# EAGLE design ESP (EAGLE 7.6.0)
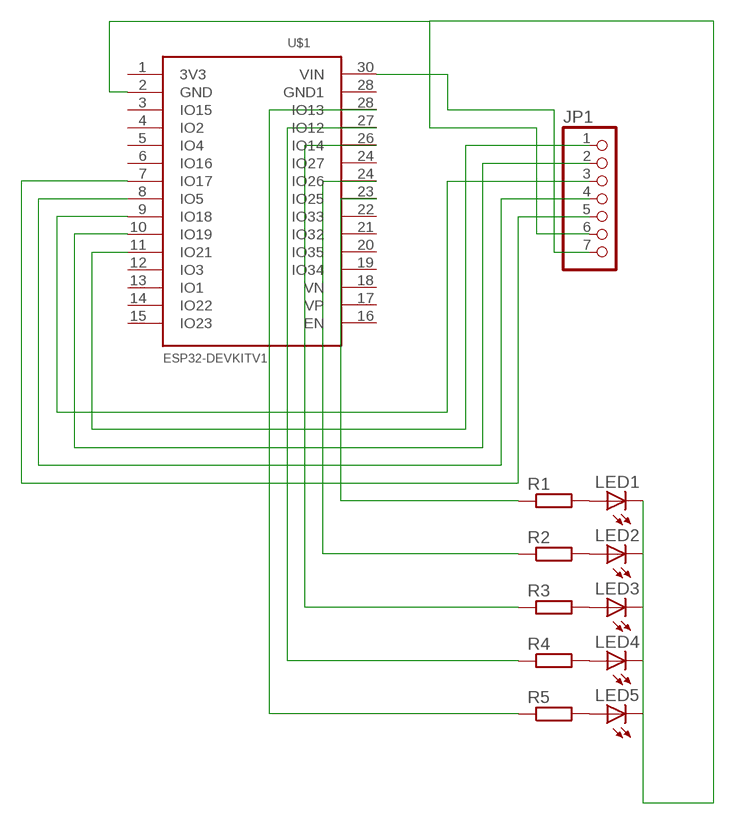
[diagram p0: schematic, sheet 1]

## Parts
JP1  PINHD-1X7  [1X07]
LED1  LED5MM  [LED5MM]
LED2  LED5MM  [LED5MM]
LED3  LED5MM  [LED5MM]
LED4  LED5MM  [LED5MM]
LED5  LED5MM  [LED5MM]
R1  R-EU_0207/7  [0207/7]
R2  R-EU_0207/7  [0207/7]
R3  R-EU_0207/7  [0207/7]
R4  R-EU_0207/7  [0207/7]
R5  R-EU_0207/7  [0207/7]
U$1  ESP32DEVKITV1  [ESP32-DEVKITV1]

## Nets
N$1: JP1.7 U$1.30(VIN)
N$2: JP1.6 LED1.K(C) LED2.K(C) LED3.K(C) LED4.K(C) LED5.K(C) U$1.2(GND)
N$3: R2.1 U$1.24(IO26)
N$4: JP1.1 U$1.11(IO21)
N$5: JP1.2 U$1.10(IO19)
N$6: JP1.3 U$1.9(IO18)
N$7: JP1.4 U$1.8(IO5)
N$8: LED1.A R1.2
N$9: LED2.A R2.2
N$10: LED3.A R3.2
N$11: LED4.A R4.2
N$12: LED5.A R5.2
N$13: JP1.5 U$1.7(IO17)
N$14: R1.1 U$1.23(IO25)
N$15: R3.1 U$1.26(IO14)
N$16: R4.1 U$1.27(IO12)
N$17: R5.1 U$1.28(IO13)
Unconnected: U$1.1(3V3) U$1.3(IO15) U$1.4(IO2) U$1.5(IO4) U$1.6(IO16) U$1.12(IO3) U$1.13(IO1) U$1.14(IO22) U$1.15(IO23) U$1.16(EN) U$1.17(VP) U$1.18(VN) U$1.19(IO34) U$1.20(IO35) U$1.21(IO32) U$1.22(IO33) U$1.24(IO27) U$1.28(GND1)

## Library data of the parts
JP1 = pinhead:PINHD-1X7: PIN HEADER
LED1-LED5 = led:LED: LED OSRAM: - CHIPLED LG R971, LG N971, LY N971, LG Q971, LY Q971, LO R971, LY R971 LH N974, LH R974 LS Q976, LO Q976, LY Q976 LO Q996 - Hyper CHIPLED LW Q18S LB Q993, LB Q99A, LB R99A - SideLED LS A670, LO A670, LY A670, LG A670, LP A670 LB A673, LV A673, LT A673, LW A673 LH A674 LY A675 LS A676, LA A676, LO A676, LY A676, LW A676 LS A679, LY A679, LG A679 - Hyper Micro SIDELED® LS Y876, LA Y876, LO Y876, LY Y876 LT Y87S - SmartLED LW L88C, LW L88S LB L89C, LB L89S, LG L890 LS L89K, LO L89K, LY L89K LS L896, LA L896, LO L896, LY L896 - TOPLED LS T670, LO T670, LY T670, LG T670, LP T670 LSG T670, LSP T670, LSY T670, LOP T670, LYG T670 LG T671, LOG T671, LSG T671 LB T673, LV T673, LT T673, LW T673 LH T674 LS T676, LA T676, LO T676, LY T676, LB T676, LH T676, LSB T676, LW T676 LB T67C, LV T67C, LT T67C, LS T67K, LO T67K, LY T67K, LW E67C LS E67B, LA E67B, LO E67B, LY E67B, LB E67C, LV E67C, LT E67C LW T67C LS T679, LY T679, LG T679 LS T770, LO T770, LY T770, LG T770, LP T770 LB T773, LV T773, LT T773, LW T773 LH T774 LS E675, LA E675, LY E675, LS T675 LS T776, LA T776, LO T776, LY T776, LB T776 LHGB T686 LT T68C, LB T68C - Hyper Mini TOPLED® LB M676 - Mini TOPLED Santana® LG M470 LS M47K, LO M47K, LY M47K Source: http://www.osram.convergy.de LUXEON: - LUMILED® LXK2-PW12-R00, LXK2-PW12-S00, LXK2-PW14-U00, LXK2-PW14-V00 LXK2-PM12-R00, LXK2-PM12-S00, LXK2-PM14-U00 LXK2-PE12-Q00, LXK2-PE12-R00, LXK2-PE12-S00, LXK2-PE14-T00, LXK2-PE14-U00 LXK2-PB12-K00, LXK2-PB12-L00, LXK2-PB12-M00, LXK2-PB14-N00, LXK2-PB14-P00, LXK2-PB14-Q00 LXK2-PR12-L00, LXK2-PR12-M00, LXK2-PR14-Q00, LXK2-PR14-R00 LXK2-PD12-Q00, LXK2-PD12-R00, LXK2-PD12-S00 LXK2-PH12-R00, LXK2-PH12-S00 LXK2-PL12-P00, LXK2-PL12-Q00, LXK2-PL12-R00 Source: www.luxeon.com KINGBRIGHT: KA-3528ASYC Source: www.kingbright.com
R1-R5 = resistor:R-EU_: RESISTOR, European symbol
U$1 = ESP32-DEVKITV1:ESP32DEVKITV1

## Board
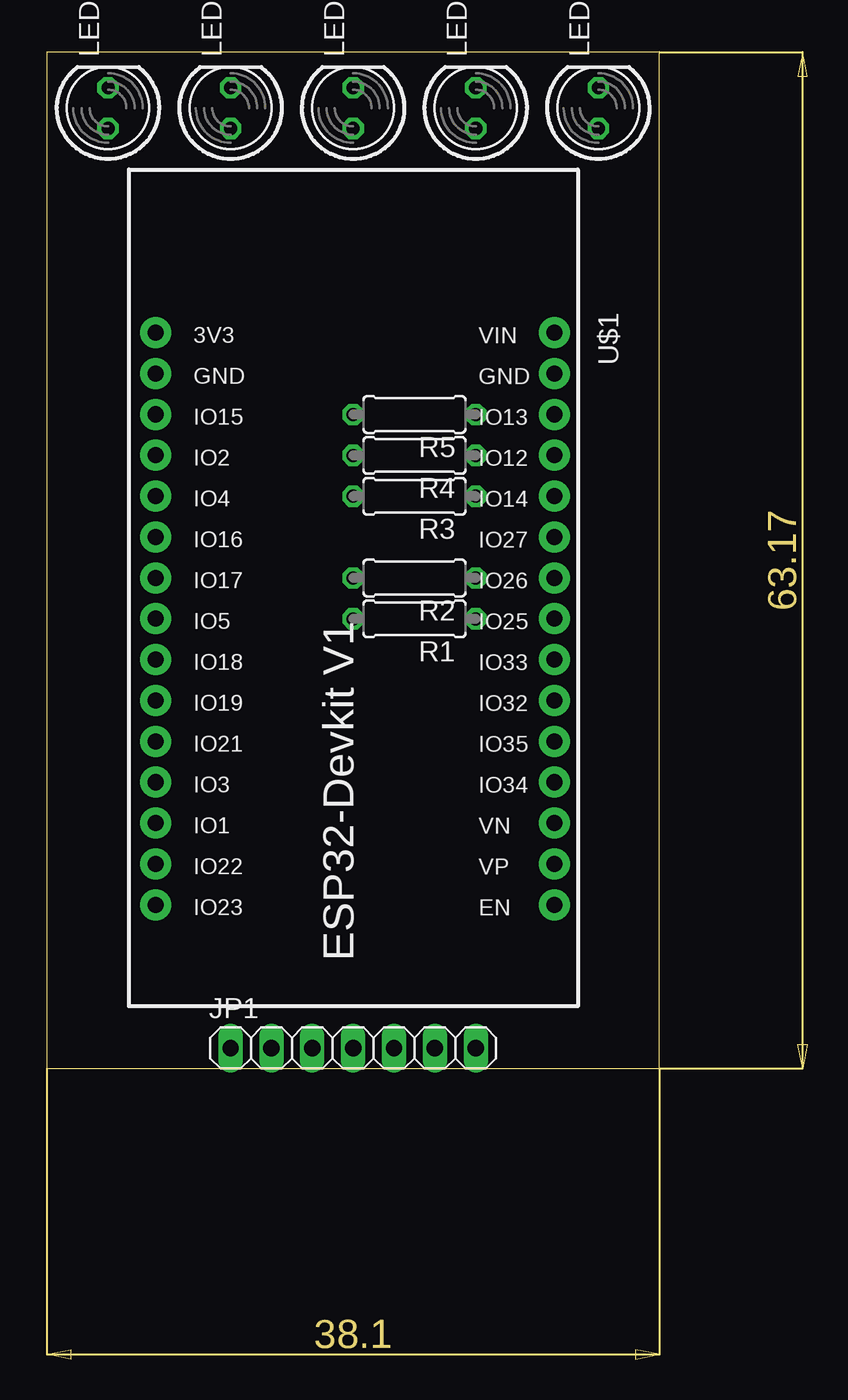
[diagram p1: board, top side]
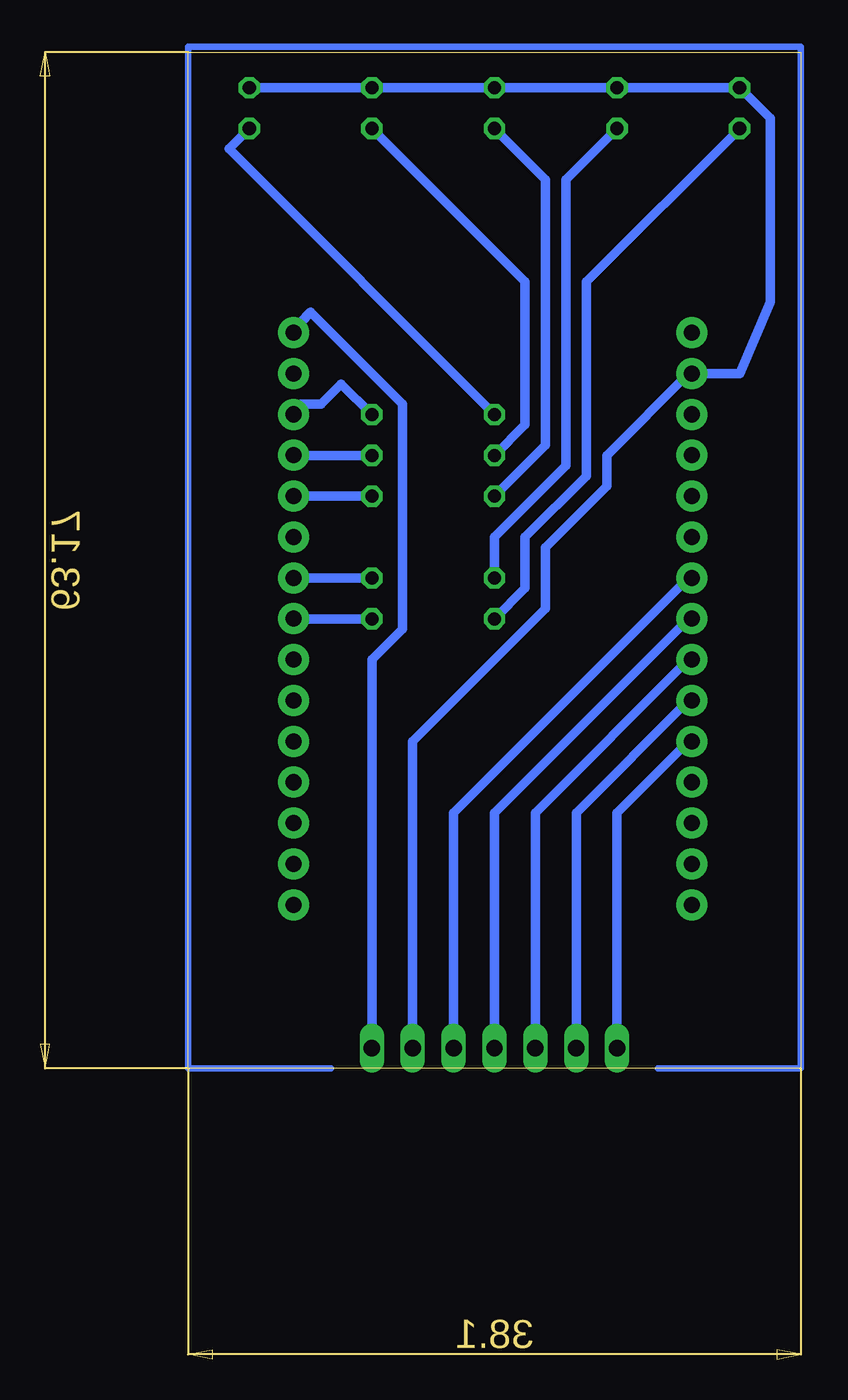
[diagram p2: board, bottom side, seen from below]

Size 38.08 x 63.17 mm. Coordinates in mm from the lower left corner, seen from the top.
Outline: 0,0 38.08,0 38.08,63.17 0,63.17 0,0
Copper layers (1*16): Top 0.035mm / dielectric 1.5mm / Bottom 0.035mm
Design rules "default *": minimum track width 0.6mm, minimum drill 24mil, track to track 0.6mm, track to pad 0.6mm, pad to pad 8mil, via to via 8mil, smd to smd 8mil, copper to edge 40mil, drill to drill 8mil, minimum pad ring 10mil, minimum via ring 8mil, stop-mask expansion 4mil, vias tented up to drill 0mil, thermal gap 10mil

### Footprints (pad centres in the part's own frame; a part is rotated, then mirrored left to right if it is on the bottom)
1X07 = drill 1.016 long: 1 -7.62,0; 2 -5.08,0; 3 -2.54,0; 4 0,0; 5 2.54,0; 6 5.08,0; 7 7.62,0
LED5MM = drill 0.813 octagon: A -1.27,0; K 1.27,0
0207/7 = drill 0.813 octagon: 1 -3.81,0; 2 3.81,0
ESP32-DEVKITV1 = drill 1 pad 1.93: 1 -22.87,-13.54; 2 -20.33,-13.54; 3 -17.79,-13.54; 4 -15.25,-13.54; 5 -12.71,-13.54; 6 -10.17,-13.54; 7 -7.63,-13.54; 8 -5.09,-13.54; 9 -2.55,-13.54; 10 -0.01,-13.54; 11 2.53,-13.54; 12 5.07,-13.54; 13 7.61,-13.54; 14 10.15,-13.54; 15 12.69,-13.54; 16 12.69,11.23; 17 10.15,11.23; 18 7.61,11.23; 19 5.07,11.23; 20 2.53,11.23; 21 -0.01,11.23; 22 -2.55,11.23; 23 -5.09,11.23; 24 -7.63,11.23; 25 -10.17,11.23; 26 -12.71,11.23; 27 -15.25,11.23; 28 -17.79,11.23; 29 -20.33,11.23; 30 -22.87,11.23

### Placement (x,y rotation side)
JP1  19.05,1.27 0 top
LED1  3.81,59.69 90 top
LED2  11.43,59.69 90 top
LED3  19.05,59.69 90 top
LED4  26.67,59.69 90 top
LED5  34.29,59.69 90 top
R1  22.86,27.94 180 top
R2  22.86,30.48 180 top
R3  22.86,35.56 180 top
R4  22.86,38.1 180 top
R5  22.86,40.64 180 top
U$1  20.32,22.86 270 top

### Tracks (layer width: path | path; a pad name or v marks a point on that pad's centre or on a via)
N$1
  Bottom 0.6: JP1.7 26.67,25.4 24.77,27.3 24.77,41.27 30.48,46.99 31.11,46.35 U$1.30
N$2
  Bottom 0.6: LED5.K LED4.K LED3.K LED2.K LED1.K 1.91,59.05 1.91,47.62 3.81,43.18 U$1.2 6.99,43.18 12.06,38.1 12.06,36.2 15.88,32.38 15.88,28.57 24.13,20.32 JP1.6
N$3
  Bottom 0.6: R2.1 31.11,30.48 U$1.24
N$4
  Bottom 0.6: JP1.1 11.43,15.88 6.99,20.32 U$1.11
N$5
  Bottom 0.6: JP1.2 13.97,15.88 6.99,22.86 U$1.10
N$6
  Bottom 0.6: JP1.3 16.51,15.88 6.99,25.4 U$1.9
N$7
  Bottom 0.6: JP1.4 19.05,15.88 6.99,27.94 U$1.8
N$8
  Bottom 0.6: R1.2 17.14,29.84 17.14,33.02 13.34,36.83 13.34,48.89 LED1.A
N$9
  Bottom 0.6: R2.2 19.05,33.02 14.61,37.46 14.61,55.24 LED2.A
N$10
  Bottom 0.6: R3.2 15.88,38.73 15.88,55.24 LED3.A
N$11
  Bottom 0.6: R4.2 17.14,40 17.14,48.89 LED4.A
N$12
  Bottom 0.6: R5.2 35.56,57.15 LED5.A
N$13
  Bottom 0.6: JP1.5 21.59,15.88 6.99,30.48 U$1.7
N$14
  Bottom 0.6: R1.1 31.11,27.94 U$1.23
N$15
  Bottom 0.6: R3.1 31.11,35.56 U$1.26
N$16
  Bottom 0.6: R4.1 31.11,38.1 U$1.27
N$17
  Bottom 0.6: R5.1 28.57,42.54 29.84,41.27 31.11,41.27 U$1.28
N$19
  Bottom 0.406: 29.21,0 38.1,0 38.1,63.5 0,63.5 0,0 8.89,0